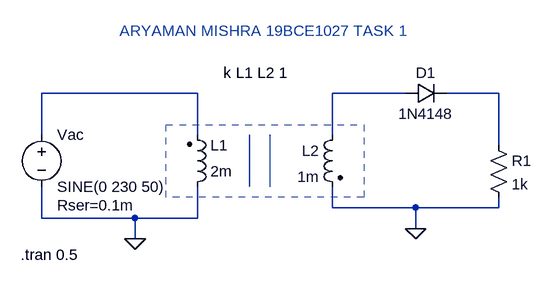
[diagram p0: schematic TASK12 (1).asc]
TASK12 (1).asc, the LTspice schematic file:
Version 4
SHEET 1 880 680
WIRE 304 16 64 16
WIRE 624 16 512 16
WIRE 768 16 688 16
WIRE 64 80 64 16
WIRE 304 80 304 16
WIRE 512 80 512 16
WIRE 768 96 768 16
WIRE 512 192 512 160
WIRE 640 192 512 192
WIRE 768 192 768 176
WIRE 768 192 640 192
WIRE 64 208 64 160
WIRE 208 208 64 208
WIRE 304 208 304 160
WIRE 304 208 208 208
WIRE 640 224 640 192
WIRE 208 240 208 208
FLAG 640 224 0
FLAG 208 240 0
SYMBOL voltage 64 64 R0
WINDOW 123 0 0 Left 0
WINDOW 39 24 124 Left 2
SYMATTR SpiceLine Rser=0.1m
SYMATTR InstName Vac
SYMATTR Value SINE(0 230 50)
SYMBOL diode 624 32 R270
WINDOW 0 32 32 VTop 2
WINDOW 3 0 32 VBottom 2
SYMATTR InstName D1
SYMATTR Value 1N4148
SYMBOL res 752 80 R0
SYMATTR InstName R1
SYMATTR Value 1k
SYMBOL ind2 288 176 M180
WINDOW 0 36 80 Left 2
WINDOW 3 36 40 Left 2
SYMATTR InstName L1
SYMATTR Value 2m
SYMATTR Type ind
SYMBOL ind2 528 64 M0
SYMATTR InstName L2
SYMATTR Value 1m
SYMATTR Type ind
TEXT 344 -16 Left 2 !k L1 L2 1
TEXT 32 264 Left 2 !.tran 0.5
TEXT 184 -80 Left 2 ;ARYAMAN MISHRA 19BCE1027 TASK 1
LINE Normal 416 160 416 80
LINE Normal 384 160 384 80
RECTANGLE Normal 560 176 256 64 2

The netlist it stands for:
* TASK12 (1).asc
Vac N001 0 SINE(0 230 50) Rser=0.1m
D1 N002 N003 1N4148
R1 N003 0 1k
L1 0 N001 2m
L2 N002 0 1m
.model D D
.lib standard.dio
k L1 L2 1
.tran 0.5
* ARYAMAN MISHRA 19BCE1027 TASK 1
.backanno
.end